# Altium schematic sheet uC_output.SchDoc
size A; SheetNumber: 11; SheetTotal: 12
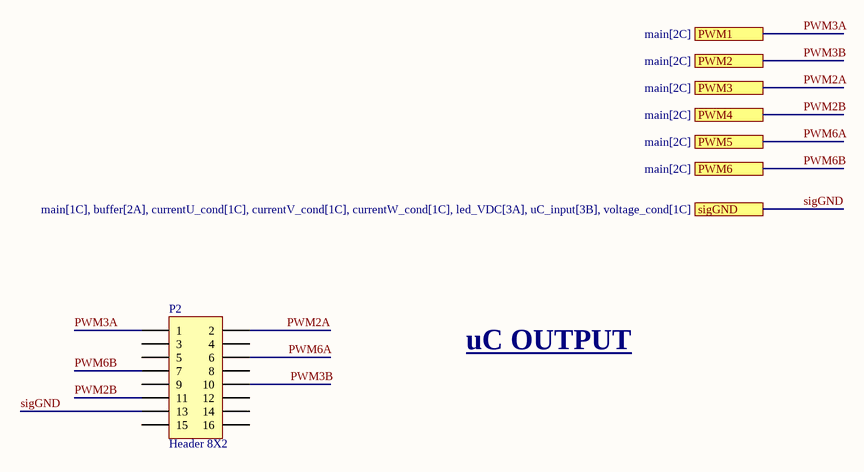
[diagram p0: uC_output.SchDoc]

## Parts
P2  Header 8X2  [HDR2X8_mod]

## Ports
PWM1 (see main[2C]), PWM2 (see main[2C]), PWM3 (see main[2C]), PWM4 (see main[2C]), PWM5 (see main[2C]), PWM6 (see main[2C]), sigGND (see main[1C], buffer[2A], currentU_cond[1C], currentV_cond[1C], currentW_cond[1C], led_VDC[3A], uC_input[3B], voltage_cond[1C])

## Nets
PWM2A: P2.2 ; port PWM3
PWM2B: P2.11 ; port PWM4
PWM3A: P2.1 ; port PWM1
PWM3B: P2.10 ; port PWM2
PWM6A: P2.6 ; port PWM5
PWM6B: P2.7 ; port PWM6
sigGND: P2.13 ; port sigGND

Not connected (* = marked no-connect by the designer): P2 3 4 5 8 9 12 14 15 16

## Notes on the sheet
- uC OUTPUT

## Library data of the parts
P2 = Header 8X2: Header, 8-Pin, Dual row; LatestRevisionDate: 17-Jul-2002; LatestRevisionNote: Re-released for DXP Platform.; Publisher: Altium Limited